# EAGLE design type-1 4 button (EAGLE 9.6.2)
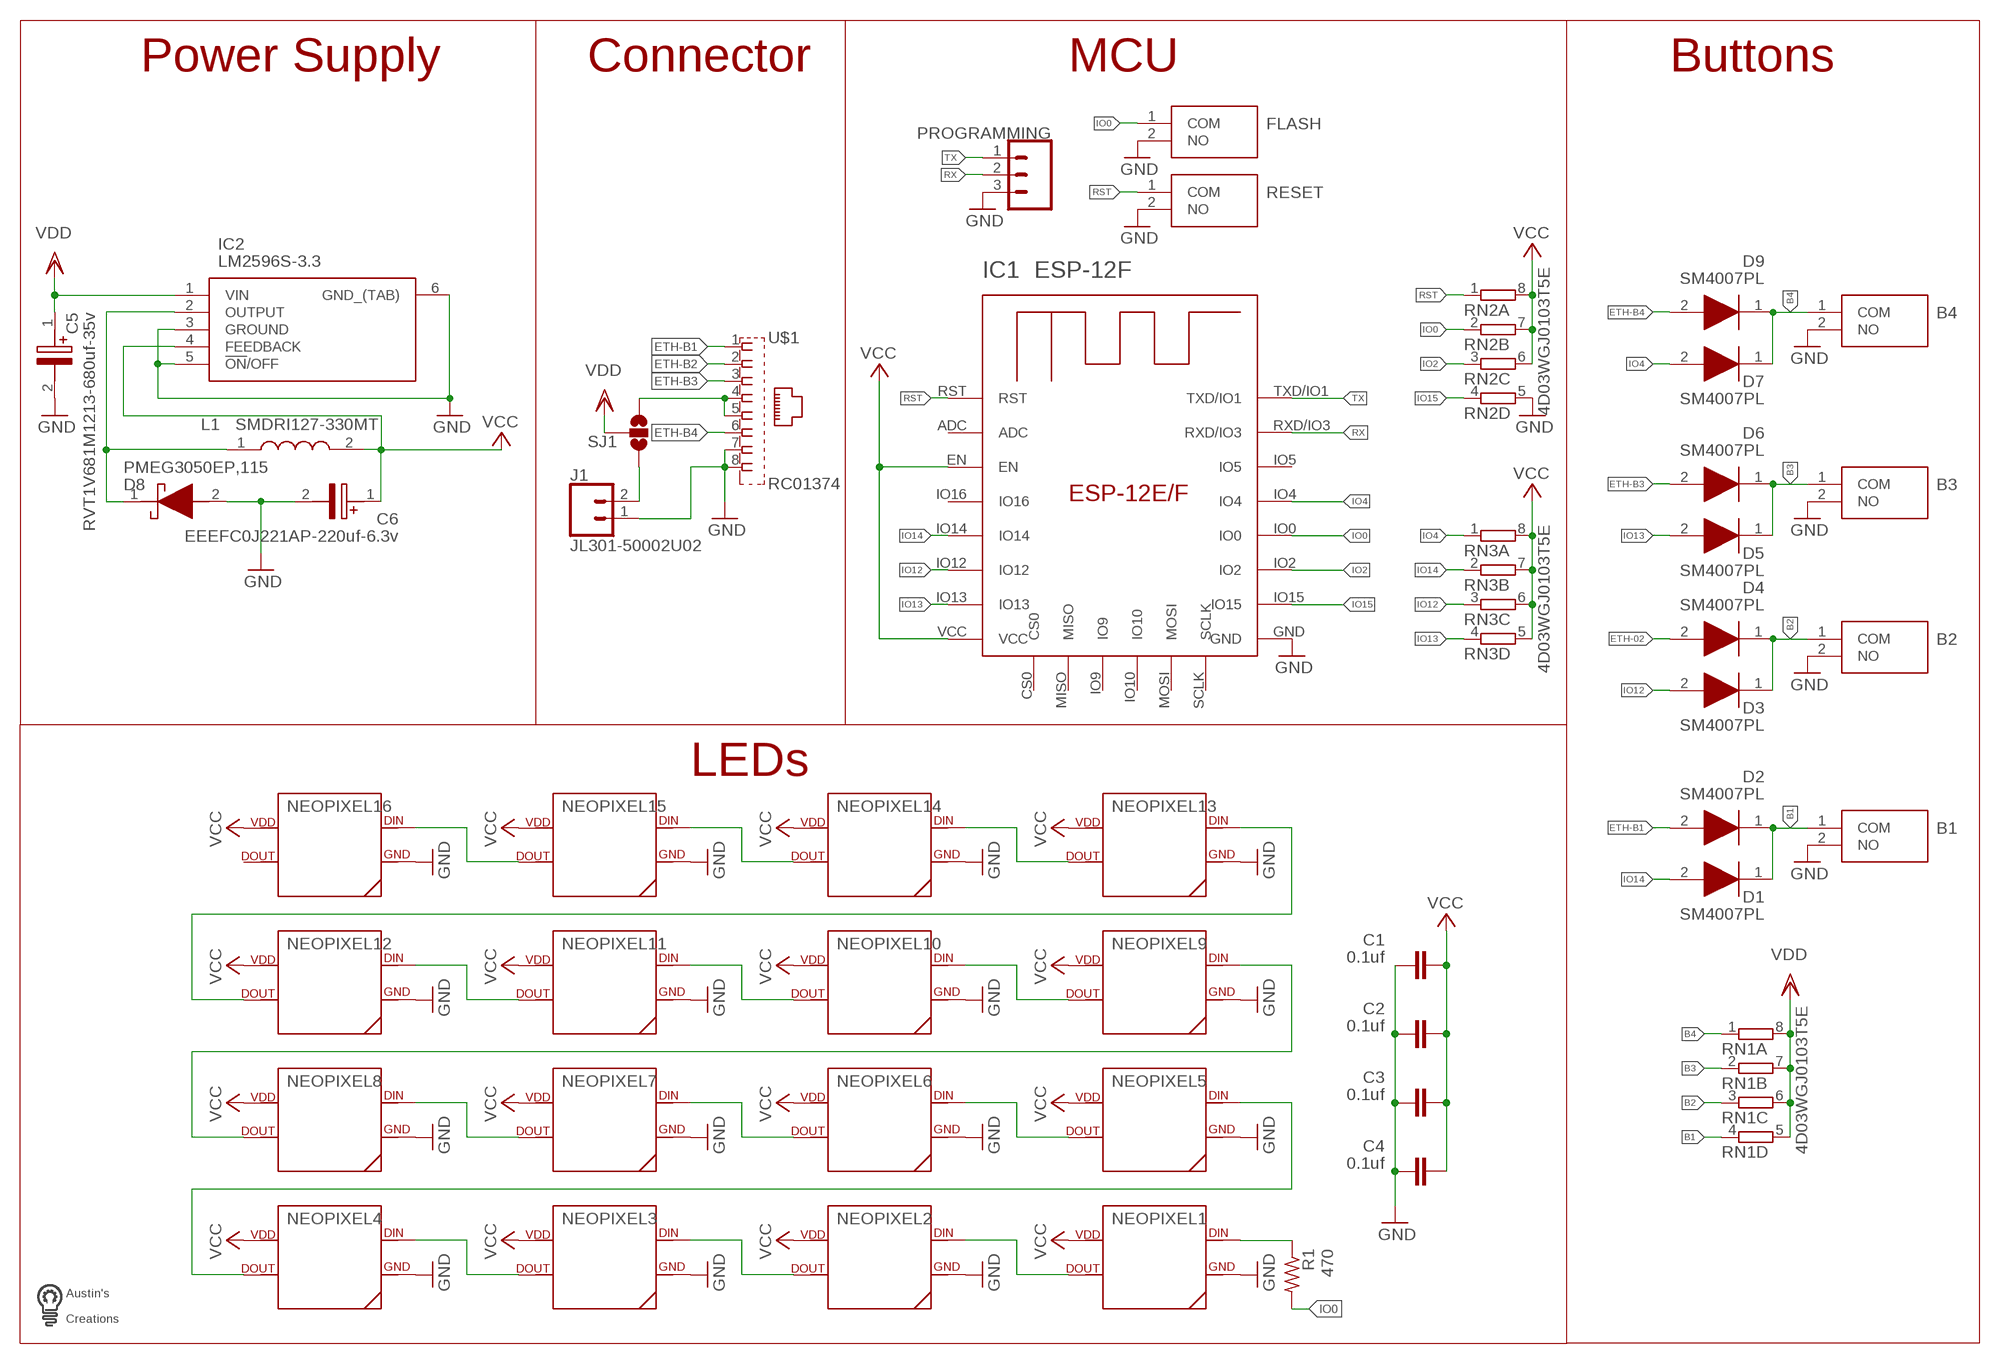
[diagram p0: schematic, sheet 1]

## Parts
B1  PTS636_SM25F_SMTR_LFS  [PTS636SM25FSMTRLFS]
B2  PTS636_SM25F_SMTR_LFS  [PTS636SM25FSMTRLFS]
B3  PTS636_SM25F_SMTR_LFS  [PTS636SM25FSMTRLFS]
B4  PTS636_SM25F_SMTR_LFS  [PTS636SM25FSMTRLFS]
C1  0.1uf  C-EUC0603  [C0603]
C2  0.1uf  C-EUC0603  [C0603]
C3  0.1uf  C-EUC0603  [C0603]
C4  0.1uf  C-EUC0603  [C0603]
C5  RVT1V681M1213-680uf-35v  EEE-HD1V681AQ  [CAPAE1350X1400N]
C6  EEEFC0J221AP-220uf-6.3v  EEEFC0J221AP  [CAPAE830X650N]
D1  SM4007PL  [SODFL3718X125N]
D2  SM4007PL  [SODFL3718X125N]
D3  SM4007PL  [SODFL3718X125N]
D4  SM4007PL  [SODFL3718X125N]
D5  SM4007PL  [SODFL3718X125N]
D6  SM4007PL  [SODFL3718X125N]
D7  SM4007PL  [SODFL3718X125N]
D8  PMEG3050EP,115  [PMEG3050EP115]
D9  SM4007PL  [SODFL3718X125N]
FLASH  PTS636_SM25F_SMTR_LFS  [PTS636SM25FSMTRLFS]
IC1  ESP-12F  ESP-12E/F  [ESP-12E]
IC2  LM2596S-3.3  LM2596S-3.3_NOPB  [TO170P1435X465-6N]
J1  JL301-50002U02  CONN_025MM  [SCREWTERMINAL-5MM-2]
L1  SMDRI127-330MT  CDRH127_LDNP-330MC  [INDPM120120X800N]
NEOPIXEL1  SK6812NEOPIXEL5050  [SK6812]
NEOPIXEL2  SK6812NEOPIXEL5050  [SK6812]
NEOPIXEL3  SK6812NEOPIXEL5050  [SK6812]
NEOPIXEL4  SK6812NEOPIXEL5050  [SK6812]
NEOPIXEL5  SK6812NEOPIXEL5050  [SK6812]
NEOPIXEL6  SK6812NEOPIXEL5050  [SK6812]
NEOPIXEL7  SK6812NEOPIXEL5050  [SK6812]
NEOPIXEL8  SK6812NEOPIXEL5050  [SK6812]
NEOPIXEL9  SK6812NEOPIXEL5050  [SK6812]
NEOPIXEL10  SK6812NEOPIXEL5050  [SK6812]
NEOPIXEL11  SK6812NEOPIXEL5050  [SK6812]
NEOPIXEL12  SK6812NEOPIXEL5050  [SK6812]
NEOPIXEL13  SK6812NEOPIXEL5050  [SK6812]
NEOPIXEL14  SK6812NEOPIXEL5050  [SK6812]
NEOPIXEL15  SK6812NEOPIXEL5050  [SK6812]
NEOPIXEL16  SK6812NEOPIXEL5050  [SK6812]
PROGRAMMING  455-1750-1-ND  CONN_03  [1X03]
R1  470  R-US_R0603  [R0603]
RESET  PTS636_SM25F_SMTR_LFS  [PTS636SM25FSMTRLFS]
RN1  4R-N0603-ARC  [0603-ARC]
RN2  4R-N0603-ARC  [0603-ARC]
RN3  4R-N0603-ARC  [0603-ARC]
SJ1  SOLDERJUMPER_2WAYPASTE1&2  [SJ_3_PASTE1&2]
U$1  RC01374  [RC01374]
U$2  LOGO  [LOGO]

## Nets
B1: B1.1(COM) D1.1(K) D2.1(K) RN1.4
B2: B2.1(COM) D3.1(K) D4.1(K) RN1.3
B3: B3.1(COM) D5.1(K) D6.1(K) RN1.2
B4: B4.1(COM) D7.1(K) D9.1(K) RN1.1
ETH-02: D4.2(A)
ETH-B1: D2.2(A) U$1.1
ETH-B2: U$1.2
ETH-B3: D6.2(A) U$1.3
ETH-B4: D9.2(A) U$1.6
GND: B1.2(NO) B2.2(NO) B3.2(NO) B4.2(NO) C1.1 C2.1 C3.1 C4.1 C5.2(-) C6.2(-) D8.2(A) FLASH.2(NO) IC1.GND IC2.3(GROUND) IC2.5(!ON!/OFF) IC2.6(GND_(TAB)) J1.1 NEOPIXEL1.3(GND) NEOPIXEL2.3(GND) NEOPIXEL3.3(GND) NEOPIXEL4.3(GND) NEOPIXEL5.3(GND) NEOPIXEL6.3(GND) NEOPIXEL7.3(GND) NEOPIXEL8.3(GND) NEOPIXEL9.3(GND) NEOPIXEL10.3(GND) NEOPIXEL11.3(GND) NEOPIXEL12.3(GND) NEOPIXEL13.3(GND) NEOPIXEL14.3(GND) NEOPIXEL15.3(GND) NEOPIXEL16.3(GND) PROGRAMMING.3 RESET.2(NO) RN2.5 U$1.7 U$1.8
IO0: FLASH.1(COM) IC1.IO0 R1.2 RN2.2
IO2: IC1.IO2 RN2.3
IO4: D7.2(A) IC1.IO4 RN3.1
IO12: D3.2(A) IC1.IO12 RN3.3
IO13: D5.2(A) IC1.IO13 RN3.4
IO14: D1.2(A) IC1.IO14 RN3.2
IO15: IC1.IO15 RN2.4
N$1: NEOPIXEL1.4(DIN) R1.1
N$2: NEOPIXEL1.2(DOUT) NEOPIXEL2.4(DIN)
N$3: NEOPIXEL2.2(DOUT) NEOPIXEL3.4(DIN)
N$4: NEOPIXEL3.2(DOUT) NEOPIXEL4.4(DIN)
N$5: NEOPIXEL4.2(DOUT) NEOPIXEL5.4(DIN)
N$6: NEOPIXEL8.2(DOUT) NEOPIXEL9.4(DIN)
N$7: NEOPIXEL12.2(DOUT) NEOPIXEL13.4(DIN)
N$8: NEOPIXEL5.2(DOUT) NEOPIXEL6.4(DIN)
N$9: NEOPIXEL9.2(DOUT) NEOPIXEL10.4(DIN)
N$10: NEOPIXEL13.2(DOUT) NEOPIXEL14.4(DIN)
N$11: NEOPIXEL6.2(DOUT) NEOPIXEL7.4(DIN)
N$12: NEOPIXEL10.2(DOUT) NEOPIXEL11.4(DIN)
N$13: NEOPIXEL14.2(DOUT) NEOPIXEL15.4(DIN)
N$14: NEOPIXEL7.2(DOUT) NEOPIXEL8.4(DIN)
N$15: NEOPIXEL11.2(DOUT) NEOPIXEL12.4(DIN)
N$16: NEOPIXEL15.2(DOUT) NEOPIXEL16.4(DIN)
N$17: SJ1.1 U$1.4 U$1.5
N$18: J1.2 SJ1.3
N$20: D8.1(K) IC2.2(OUTPUT) L1.1
RST: IC1.RST RESET.1(COM) RN2.1
RX: IC1.RXD/IO3 PROGRAMMING.2
TX: IC1.TXD/IO1 PROGRAMMING.1
VCC: C1.2 C2.2 C3.2 C4.2 C6.1(+) IC1.EN IC1.VCC IC2.4(FEEDBACK) L1.2 NEOPIXEL1.1(VDD) NEOPIXEL2.1(VDD) NEOPIXEL3.1(VDD) NEOPIXEL4.1(VDD) NEOPIXEL5.1(VDD) NEOPIXEL6.1(VDD) NEOPIXEL7.1(VDD) NEOPIXEL8.1(VDD) NEOPIXEL9.1(VDD) NEOPIXEL10.1(VDD) NEOPIXEL11.1(VDD) NEOPIXEL12.1(VDD) NEOPIXEL13.1(VDD) NEOPIXEL14.1(VDD) NEOPIXEL15.1(VDD) NEOPIXEL16.1(VDD) RN2.6 RN2.7 RN2.8 RN3.5 RN3.6 RN3.7 RN3.8
VDD: C5.1(+) IC2.1(VIN) RN1.5 RN1.6 RN1.7 RN1.8 SJ1.2
Unconnected: IC1.ADC IC1.CS0 IC1.IO5 IC1.IO9 IC1.IO10 IC1.IO16 IC1.MISO IC1.MOSI IC1.SCLK NEOPIXEL16.2(DOUT)

## Notes on the sheet
- Power Supply | Connector | MCU | Buttons
- 4D03WGJ0103T5E
- 4D03WGJ0103T5E
- LEDs
- 4D03WGJ0103T5E

## Library data of the parts
B1-B4 FLASH RESET = SamacSys_Parts:PTS636_SM25F_SMTR_LFS: Tactile Switches Tact 50mA 12VDC, 6.0x3.5, 2.5mm H, 180gf, F leads, No ground pin, White Actuator Source: Datasheet <https://ms.componentsearchengine.com/Datasheets/1/PTS636 SM25F SMTR LFS.pdf>; ARROW_PART_NUMBER: PTS636 SM25F SMTR LFS; ARROW_PRICE-STOCK: https://www.arrow.com/en/products/pts636-sm25f-smtr-lfs/ck; DESCRIPTION: Tactile Switches Tact 50mA 12VDC, 6.0x3.5, 2.5mm H, 180gf, F leads, No ground pin, White Actuator; HEIGHT: 2.7mm; MANUFACTURER_NAME: C & K COMPONENTS; MANUFACTURER_PART_NUMBER: PTS636 SM25F SMTR LFS; MOUSER_PART_NUMBER: 611-PTS636SM25FSMTRL; MOUSER_PRICE-STOCK: https://www.mouser.co.uk/ProductDetail/CK/PTS636-SM25F-SMTR-LFS?qs=vLWxofP3U2wcBTQSwfMFOw%3D%3D
C1-C4 = rcl:C-EU: CAPACITOR, European symbol; SPICEPREFIX: C
C5 = SamacSys_Parts:EEE-HD1V681AQ: Aluminium Electrolytic Capacitors - SMD 35VDC 680uF 20% AEC-Q200 Source: Datasheet <https://industrial.panasonic.com/cdbs/www-data/pdf/RDE0000/ABA0000C1166.pdf>; DESCRIPTION: Aluminium Electrolytic Capacitors - SMD 35VDC 680uF 20% AEC-Q200; HEIGHT: 14mm; MANUFACTURER_NAME: Panasonic; MANUFACTURER_PART_NUMBER: EEE-HD1V681AQ; MOUSER_PART_NUMBER: 667-EEE-HD1V681AQ; MOUSER_PRICE-STOCK: https://www.mouser.co.uk/ProductDetail/Panasonic/EEE-HD1V681AQ?qs=w%2Fv1CP2dgqoW7i2Hoqi%252B9w%3D%3D
C6 = SamacSys_Parts:EEEFC0J221AP: PANASONIC - EEEFC0J221AP - SMD Aluminium Electrolytic Capacitor, Radial Can - SMD, 220 F, 6.3 V, EEEFC Series Source: Datasheet <https://industrial.panasonic.com/cdbs/www-data/pdf/RDE0000/ABA0000C1169.pdf>; DESCRIPTION: PANASONIC - EEEFC0J221AP - SMD Aluminium Electrolytic Capacitor, Radial Can - SMD, 220 F, 6.3 V, EEEFC Series; HEIGHT: 6.5mm; MANUFACTURER_NAME: Panasonic; MANUFACTURER_PART_NUMBER: EEEFC0J221AP
D1-D7 D9 = SamacSys_Parts:SM4007PL: 1kV 1A 1.1V @ 1A SOD-123FL Diodes - General Purpose RoHS Source: Datasheet <https://datasheet.lcsc.com/szlcsc/1903051030_MDD-Jiangsu-Yutai-Elec-SM4007PL_C64898.pdf>; DESCRIPTION: 1kV 1A 1.1V @ 1A SOD-123FL Diodes - General Purpose RoHS; HEIGHT: 1.25mm; MANUFACTURER_NAME: MDD(Microdiode Electronics); MANUFACTURER_PART_NUMBER: SM4007PL
D8 = SamacSys_Parts:PMEG3050EP,115: NXP PMEG3050EP,115 SMT Schottky Diode, 30V 5A, 2-Pin SOD-128 Source: Datasheet <https://docs-emea.rs-online.com/webdocs/14cd/0900766b814cd012.pdf>; ARROW_PART_NUMBER: PMEG3050EP,115; ARROW_PRICE-STOCK: https://www.arrow.com/en/products/pmeg3050ep115/nexperia; DESCRIPTION: NXP PMEG3050EP,115 SMT Schottky Diode, 30V 5A, 2-Pin SOD-128; HEIGHT: 1mm; MANUFACTURER_NAME: Nexperia; MANUFACTURER_PART_NUMBER: PMEG3050EP,115; MOUSER_PART_NUMBER: 771-PMEG3050EP115; MOUSER_PRICE-STOCK: https://www.mouser.co.uk/ProductDetail/Nexperia/PMEG3050EP115?qs=GcY6OjH1zdmnjQ%2FhUT5aOA%3D%3D
IC1 = custom parts:ESP-12E/F
IC2 = SamacSys_Parts:LM2596S-3.3_NOPB: SIMPLE SWITCHER® 4.5V to 40V, 3A Low Component Count Step-Down Regulator Source: Datasheet <http://www.ti.com/lit/ds/symlink/lm2596.pdf>; DESCRIPTION: SIMPLE SWITCHER&#174; 4.5V to 40V, 3A Low Component Count Step-Down Regulator; HEIGHT: 4.65mm; MANUFACTURER_NAME: Texas Instruments; MANUFACTURER_PART_NUMBER: LM2596S-3.3/NOPB; MOUSER_PART_NUMBER: 926-LM2596S-3.3/NOPB; MOUSER_PRICE-STOCK: https://www.mouser.co.uk/ProductDetail/Texas-Instruments/LM2596S-33-NOPB?qs=X1J7HmVL2ZHsEwG9Q6doow%3D%3D
J1 = SparkFun-Connectors:CONN_02: Multi connection point. Often used as Generic Header-pin footprint for 0.1 inch spaced/style header connections On any of the 0.1 inch spaced packages, you can populate with these: Break Away Headers - Straight <https://www.sparkfun.com/products/116> (PRT-00116) Break Away Male Headers - Right Angle <https://www.sparkfun.com/products/553> (PRT-00553) Female Headers <https://www.sparkfun.com/products/115> (PRT-00115) Break Away Headers - Machine Pin <https://www.sparkfun.com/products/117> (PRT-00117) Break Away Female Headers - Swiss Machine Pin <https://www.sparkfun.com/products/743> (PRT-00743) For SCREWTERMINALS and SPRING TERMINALS visit here: Screw Terimnals on SparkFun.com <https://www.sparkfun.com/search/results?term=Screw+Terminals> (5mm/3.5mm/2.54mm spacing) This device is also useful as a general connection point to wire up your design to another part of your project. Our various solder wires solder well into these plated through hole pads. Hook-Up Wire - Assortment (Stranded, 22 AWG) <https://www.sparkfun.com/products/11375> (PRT-11375) Hook-Up Wire - Assortment (Solid Core, 22 AWG) <https://www.sparkfun.com/products/11367> (PRT-11367) View the entire wire category on our website here <https://www.sparkfun.com/categories/141> Special notes: Molex polarized connector foot print use with: PRT-08233 with associated crimp pins and housings. 2.54_SCREWTERM for use with PRT-10571. 3.5mm Screw Terminal footprints for PRT-08084 5mm Screw Terminal footprints for use with PRT-08432; SF_SKU: PRT-08432
L1 = SamacSys_Parts:CDRH127_LDNP-330MC: Fixed Inductors 33uH 3.9A Source: Datasheet <https://products.sumida.com/products/pdf/CDRH127LD.pdf>; DESCRIPTION: Fixed Inductors 33uH 3.9A; HEIGHT: 8mm; MANUFACTURER_NAME: Sumida; MANUFACTURER_PART_NUMBER: CDRH127/LDNP-330MC; MOUSER_PART_NUMBER: 851-CDRH127LDNP330MC; MOUSER_PRICE-STOCK: https://www.mouser.co.uk/ProductDetail/Sumida/CDRH127-LDNP-330MC?qs=rZntyWl5IYHj3wgmnQ0WOg%3D%3D
NEOPIXEL1-NEOPIXEL16 = custom parts:SK6812: for 5050 sk6812 LED
PROGRAMMING = SparkFun-Connectors:CONN_03: Multi connection point. Often used as Generic Header-pin footprint for 0.1 inch spaced/style header connections On any of the 0.1 inch spaced packages, you can populate with these: Break Away Headers - Straight <https://www.sparkfun.com/products/116> (PRT-00116) Break Away Male Headers - Right Angle <https://www.sparkfun.com/products/553> (PRT-00553) Female Headers <https://www.sparkfun.com/products/115> (PRT-00115) Break Away Headers - Machine Pin <https://www.sparkfun.com/products/117> (PRT-00117) Break Away Female Headers - Swiss Machine Pin <https://www.sparkfun.com/products/743> (PRT-00743) Stackable Header - 3 Pin (Female, 0.1") <https://www.sparkfun.com/products/13875> (PRT-13875) For SCREWTERMINALS and SPRING TERMINALS visit here: Screw Terimnals on SparkFun.com <https://www.sparkfun.com/search/results?term=Screw+Terminals> (5mm/3.5mm/2.54mm spacing) This device is also useful as a general connection point to wire up your design to another part of your project. Our various solder wires solder well into these plated through hole pads. Hook-Up Wire - Assortment (Stranded, 22 AWG) <https://www.sparkfun.com/products/11375> (PRT-11375) Hook-Up Wire - Assortment (Solid Core, 22 AWG) <https://www.sparkfun.com/products/11367> (PRT-11367) View the entire wire category on our website here <https://www.sparkfun.com/categories/141> Special notes: Molex polarized connector foot print use with SKU : PRT-08232 with associated crimp pins and housings.; PROD_ID: XXX-00000
R1 = resistor:R-US_: RESISTOR, American symbol
RN1-RN3 = custom parts:4R-N: Array Chip Resistor Source: RS Component / Phycomp; OC_FARNELL: unknown; OC_NEWARK: unknown
SJ1 = SparkFun-Retired:SOLDERJUMPER_2WAY: Solder Jumper 2 way solder jumper
U$1 = custom parts:RC01374
U$2 = custom parts:LOGO

## Board
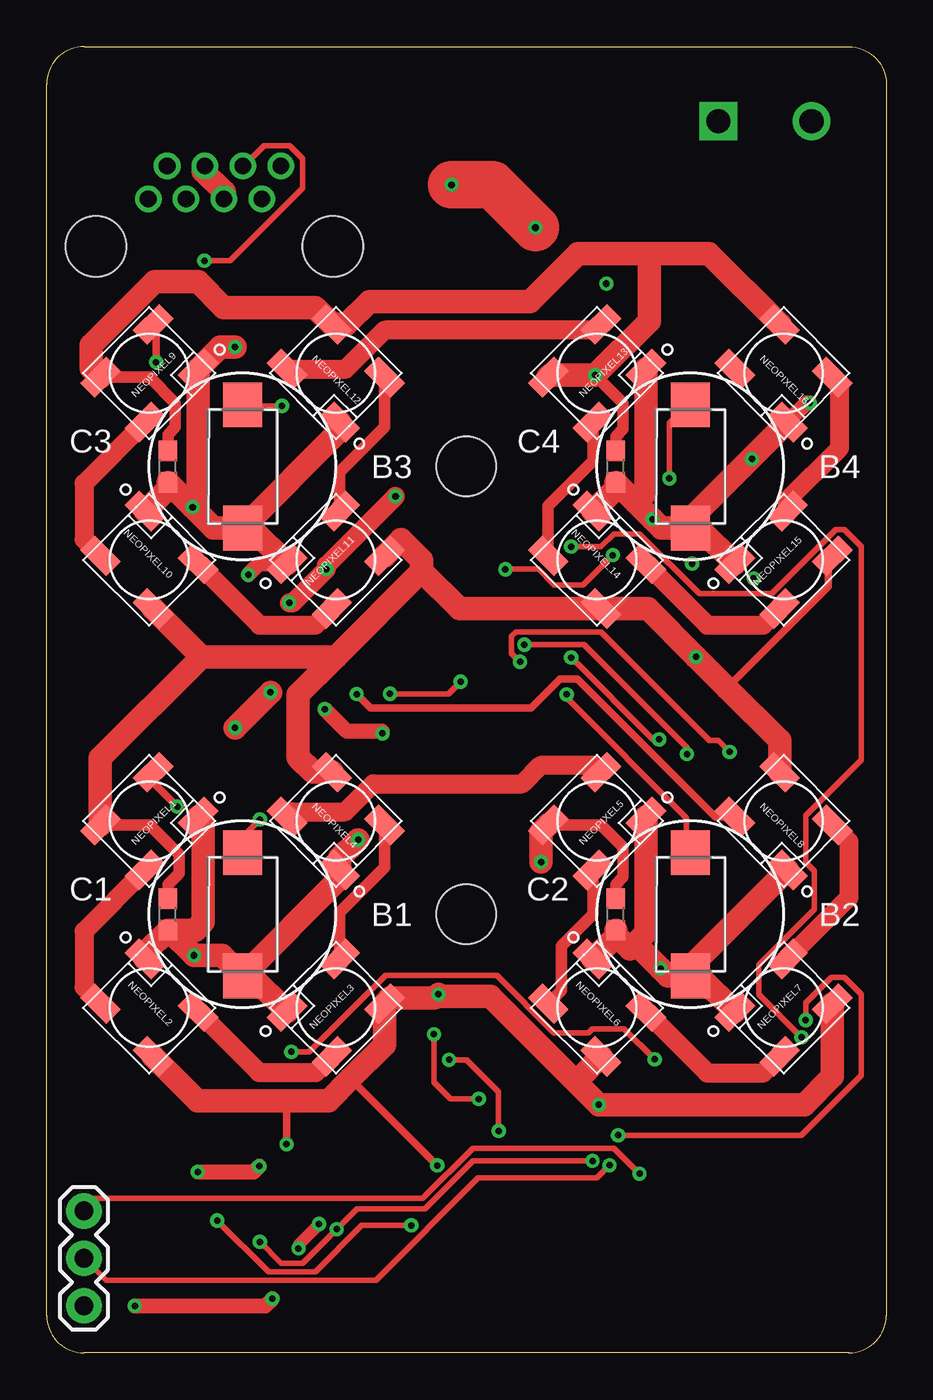
[diagram p1: board, top side]
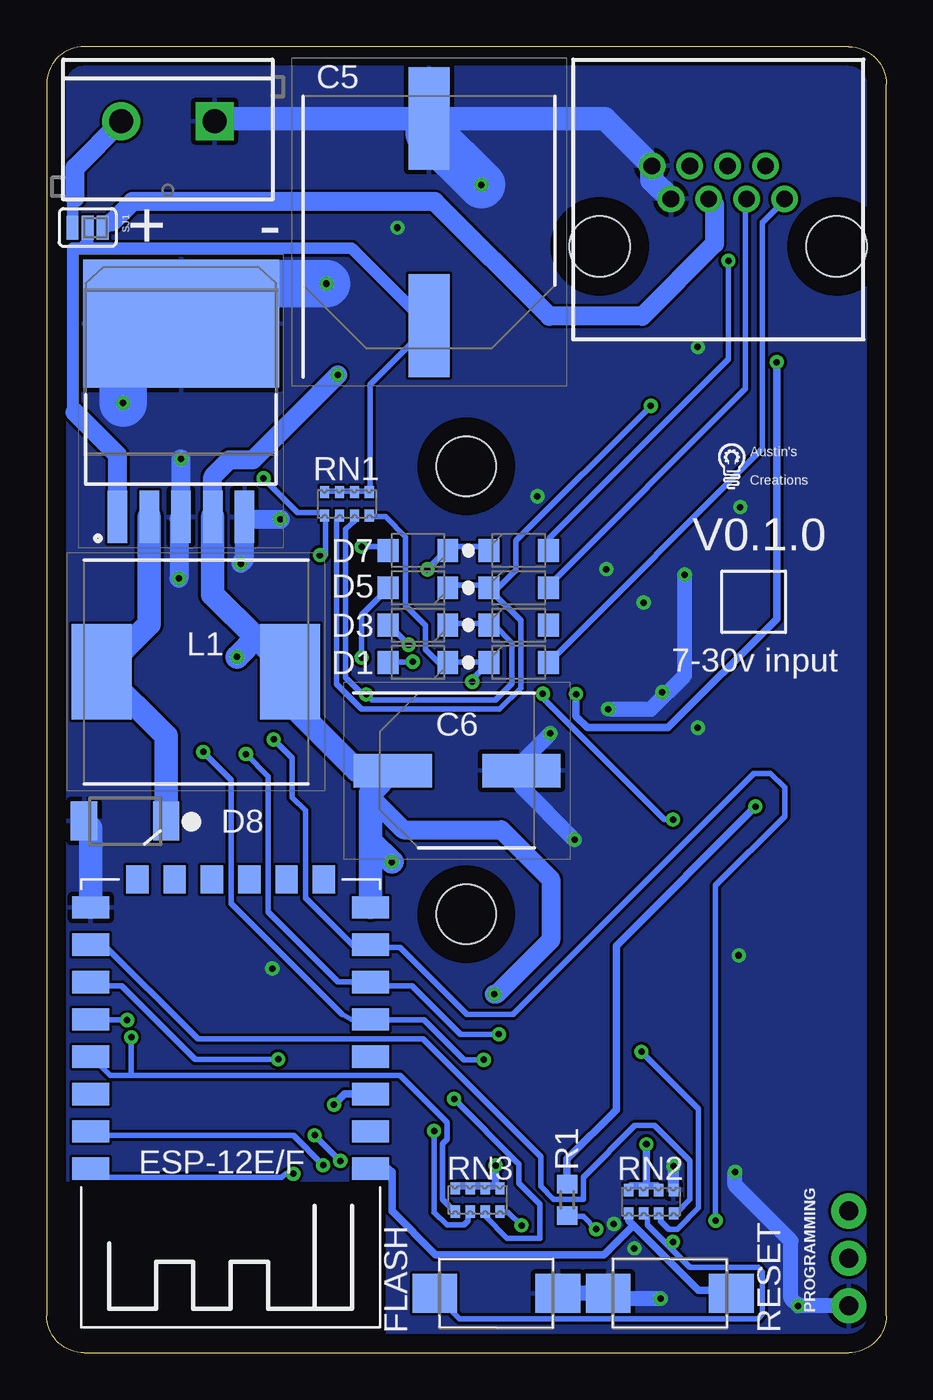
[diagram p2: board, bottom side, seen from below]

Size 45 x 70 mm. Coordinates in mm from the lower left corner, seen from the top.
Outline: 0,2 0,68 arc-90 2,70 43,70 arc-90 45,68 45,2 arc-90 43,0 2,0 arc-90 0,2
Copper layers (1*16): Top 0.035mm / dielectric 1.5mm / Bottom 0.035mm
Design rules "default *": minimum track width 12mil, minimum drill 0.35mm, track to track 6mil, track to pad 6mil, pad to pad 6mil, via to via 6mil, smd to smd 6mil, copper to edge 40mil, drill to drill 6mil, minimum pad ring 10mil, minimum via ring 8mil, stop-mask expansion 4mil, vias tented up to drill 0mil, thermal gap 10mil
Holes 3.2 mm at 22.5,47.5 22.5,23.5

### Footprints (pad centres in the part's own frame; a part is rotated, then mirrored left to right if it is on the bottom)
PTS636SM25FSMTRLFS = smd 2.4 x 2.1: 1 -3.3,0; 2 3.3,0
C0603 = smd 1.1 x 1: 1 -0.85,0; 2 0.85,0
CAPAE1350X1400N = smd 5.5 x 2.2: 1 -5.55,0; 2 5.55,0
CAPAE830X650N = smd 4.2 x 1.8: 1 -3.45,0; 2 3.45,0
SODFL3718X125N = smd 1.12 x 1.22: 1 -1.6,0; 2 1.6,0
PMEG3050EP115 = smd 1.4 x 2.1: 1 -2.2,0; 2 2.2,0
ESP-12E = smd 2 x 1.2: ADC -7.46,5.53; EN -7.46,3.53; GND 7.54,-6.47; IO0 7.54,-0.47; IO2 7.54,-2.47; IO4 7.54,1.53; IO5 7.54,3.53; IO12 -7.46,-2.47; IO13 -7.46,-4.47; IO14 -7.46,-0.47; IO15 7.54,-4.47; IO16 -7.46,1.53; RST -7.46,7.53; RXD/IO3 7.54,5.53; TXD/IO1 7.54,7.53; VCC -7.46,-6.47 | smd 1.2 x 1.5: CS0 -4.96,-7.97; IO9 -0.96,-7.97; IO10 1.04,-7.97; MISO -2.96,-7.97; MOSI 3.04,-7.97; SCLK 5.04,-7.97
TO170P1435X465-6N = smd 2.8 x 1.05: 1 -6.2,3.4; 2 -6.2,1.7; 3 -6.2,0; 4 -6.2,-1.7; 5 -6.2,-3.4 | smd 6.85 x 10.5: 6 4.15,0
SCREWTERMINAL-5MM-2 = drill 1.3 pad 2.032 square: 1 0,0 | drill 1.3 pad 2.032: 2 5,0
INDPM120120X800N = smd 3.2 x 5.1: 1 -5.05,0; 2 5.05,0
SK6812 = smd 2 x 1.1: 1 -2,1.7; 2 -2,-1.7; 3 2,-1.7; 4 2,1.7
1X03 = drill 1.016 pad 1.88: 1 0,0; 2 2.54,0; 3 5.08,0
R0603 = smd 1 x 1.1: 1 -0.85,0; 2 0.85,0
0603-ARC = smd 0.5 x 0.65: 1 -1.2,-0.625; 2 -0.4,-0.625; 3 0.4,-0.625; 4 1.2,-0.625; 5 1.2,0.625; 6 0.4,0.625; 7 -0.4,0.625; 8 -1.2,0.625
SJ_3_PASTE1&2 = smd 0.635 x 1.27: 1 -0.813,0; 2 0,0; 3 0.813,0
RC01374 = drill 0.889 pad 1.422: 1 3.556,2.54; 2 2.54,4.318; 3 1.524,2.54; 4 0.508,4.318; 5 -0.508,2.54; 6 -1.524,4.318; 7 -2.54,2.54; 8 -3.556,4.318 | hole 3.251: 6.35,0; -6.35,0

### Placement (x,y rotation side)
B1  10.5,23.5 270 top
B2  34.5,23.5 270 top
B3  10.5,47.5 270 top
B4  34.5,47.5 270 top
C1  6.5,23.5 90 top
C2  30.5,23.5 90 top
C3  6.5,47.5 90 top
C4  30.5,47.5 90 top
C5  24.5,60.6 90 bottom
C6  23,31.2 0 bottom
D1  25.1,37 180 bottom
D2  19.7,37 0 bottom
D3  25.1,39 180 bottom
D4  19.7,39 0 bottom
D5  25.1,41 180 bottom
D6  19.7,41 0 bottom
D7  25.1,43 180 bottom
D8  40.8,28.5 180 bottom
D9  19.7,43 0 bottom
FLASH  20.9,3.2 0 bottom
IC1  35.1,17.4 180 bottom
IC2  37.8,51 90 bottom
J1  36,66 180 bottom
L1  37,36.5 0 bottom
NEOPIXEL1  5.5,28.5 45 top
NEOPIXEL2  5.5,18.5 135 top
NEOPIXEL3  15.5,18.5 225 top
NEOPIXEL4  15.5,28.5 315 top
NEOPIXEL5  29.5,28.5 45 top
NEOPIXEL6  29.5,18.5 135 top
NEOPIXEL7  39.5,18.5 225 top
NEOPIXEL8  39.5,28.5 315 top
NEOPIXEL9  5.5,52.5 45 top
NEOPIXEL10  5.5,42.5 135 top
NEOPIXEL11  15.5,42.5 225 top
NEOPIXEL12  15.5,52.5 315 top
NEOPIXEL13  29.5,52.5 45 top
NEOPIXEL14  29.5,42.5 135 top
NEOPIXEL15  39.5,42.5 225 top
NEOPIXEL16  39.5,52.5 315 top
PROGRAMMING  2,7.6 270 top
R1  17.1,8.2 270 bottom
RESET  11.6,3.2 180 bottom
RN1  28.9,45.5 0 bottom
RN2  12.6,8.1 0 bottom
RN3  21.9,8.2 0 bottom
SJ1  42.8,60.3 180 bottom
U$1  9,59.3 0 bottom
U$2  9,46.3 0 bottom

### Tracks (layer width: path | path; a pad name or v marks a point on that pad's centre or on a via)
B1  (via drill 0.35)
  Top 0.305: v11.43,28.57 10.52,27.66 10.52,26.98 B1.1 | v18.4,35.32 21.55,35.32 v22.19,35.96
  Bottom 0.305: RN1.4 27.66,44.81 26.85,44.81 25.76,43.72 25.76,40.05 24.7,38.99 24.7,37.7 24,37 D1.1 23.32,37.03 21.49,37.03 D2.1 22.19,36.08 v22.19,35.96 | v11.43,28.57 11.89,28.57 18.4,35.09 v18.4,35.32
B2  (via drill 0.35)
  Top 0.305: v27.88,35.29 27.88,35.09 34.29,28.68 34.29,26.98 B2.1
  Bottom 0.305: RN1.3 28.5,44.58 28.98,44.13 28.98,36.19 28.07,35.29 v27.88,35.29 27.56,34.98 20.93,34.98 20.05,35.86 20.05,38.05 21,39 D4.1 21.49,39.09 23.32,39.09 D3.1
B3  (via drill 0.35)
  Top 0.305: v12.62,50.75 10.52,50.75 B3.1
  Bottom 0.305: RN1.2 29.46,44.71 29.46,35.83 28.13,34.5 20.72,34.5 19.59,35.63 19.59,39.25 21.26,40.92 D6.1 | D5.1 23.32,41.15 21.49,41.15 D6.1 | v12.62,50.75 19.84,43.52 19.84,41.96 20.81,41 D6.1
B4  (via drill 0.35)
  Top 0.305: v33.38,46.86 33.38,49.84 34.29,50.75 B4.1 | v24.59,41.99 26.36,41.99 27.2,41.15 28.75,41.15 v30.35,42.75
  Bottom 0.305: D9.1 21.49,43.2 23.32,43.2 D7.1 23.52,43.06 v24.59,41.99 | v33.38,46.86 31.55,45.03 30.18,45.03 RN1.1 30.05,44.82 30.05,42.75 v30.35,42.75
ETH-B1
  Bottom 0.305: D2.2 18.06,37.03 6.63,48.46 6.63,60.58 5.49,61.72 U$1.1
ETH-B3
  Bottom 0.305: D6.2 18.06,41.15 7.54,51.66 7.54,61.72 U$1.3
ETH-B4  (via drill 0.35)
  Top 0.305: v8.46,58.52 9.83,58.52 13.72,62.41 13.72,64.01 13.03,64.69 11.66,64.69 10.74,63.78 U$1.6
  Bottom 0.305: v8.46,58.52 8.46,53.26 18.06,43.66 18.06,43.2 D9.2
GND  (via drill 0.35)
  Top 0.61: v14.6,6.9 13.5,5.8 v13.5,5.6
  Top 0.813: v8.1,9.7 11.1,9.7 v11.4,10 | v4.72,2.52 11.72,2.52 v12.1,2.9 | v18,33.2 18,33.3 16.1,33.3 v14.9,34.5 | v10.8,41.7 11.39,42.29 NEOPIXEL11.3 | NEOPIXEL16.3 40.73,50.9 v40.9,50.9
  Top 1.016: v18.7,45.9 15,42.2 v15,42 13.2,40.2 v13,40.2
  Top 1.27: B1.2 15.71,25.41 NEOPIXEL4.3 15.71,26.51 v16.7,27.5 | NEOPIXEL2.3 5.29,21.44 C1.1 | C1.1 6.55,22.65 v7.9,21.3 9.4,21.3 B1.2 | C1.1 7.95,22.65 8.4,23.1 8.4,28.43 NEOPIXEL1.3 | NEOPIXEL3.3 10.97,20.2 B1.2 | NEOPIXEL7.3 34.97,20.2 B2.2 | B2.2 33.3,20.2 v32.9,20.6 31.55,21.95 | NEOPIXEL6.3 30.5,22.33 C2.1 30.5,22.4 31.25,21.65 31.55,21.95 | NEOPIXEL5.3 32.12,22.52 31.55,21.95 | NEOPIXEL8.3 34.5,20.67 B2.2 | B4.2 32.95,44.2 v32.48,44.67 31.57,45.58 | 31.57,45.58 C4.1 30.5,46.33 NEOPIXEL14.3 | B4.2 34.97,44.2 NEOPIXEL15.3 | B4.2 34.5,44.67 NEOPIXEL16.3 | NEOPIXEL13.3 32.12,46.12 31.57,45.58 | B3.2 8.95,44.2 v7.83,45.33 | v7.83,45.33 C3.1 6.5,46.33 NEOPIXEL10.3 | B3.2 10.97,44.2 NEOPIXEL11.3 | B3.2 15.71,49.41 NEOPIXEL12.3 | v7.83,45.33 8.12,45.62 NEOPIXEL9.3 9.3,53.9 v10.1,53.9 | v12,35.4 v10.1,33.5
  Top 2.54: v21.7,62.6 23.9,62.6 v26.2,60.3
  Bottom 0.61: v11.4,10 RN2.5
  Bottom 0.813: PROGRAMMING.3 v4.72,2.52 5.1,2.9 5.1,6 8.1,9 v8.1,9.7 | v12.1,2.9 14.6,2.9 RESET.2 FLASH.2 | v16.7,27.5 19.55,30.35 C6.2 19.55,31.65 v18,33.2 | v14.9,34.5 12.6,34.5 10.8,36.3 v10.8,41.7
  Bottom 1.016: v37.8,47.9 IC2.3 37.9,44.7 v37.9,41.5 | v34.6,42.3 34.4,42.5 IC2.5 34.27,44.67 v32.48,44.67
  Bottom 1.27: IC1.GND 42.64,28.14 D8.2 | U$1.7 12.56,62.86 U$1.8 15.09,66.15 C5.2 35.85,66.15 J1.1
  Bottom 2.54: v30,57.3 36.4,57.3 40.9,52.8 v40.9,50.9 | C5.2 24.5,65.4 v21.7,62.6
  pour Bottom: 0,0 0,70 45,70 45,9.2 26.8,9.2 26.8,0
IO0  (via drill 0.35)
  Top 0.305: v11.43,5.94 12.57,4.8 13.72,4.8 v15.54,6.63 16.63,7.71 20.29,7.71 22.86,10.29 v29.26,10.29 | v40.69,17.83 40.69,18.75 42.06,20.12 42.75,20.12 43.66,19.2 43.66,14.86 40.46,11.66 v30.63,11.66
  Bottom 0.305: 11.66,5.71 10.52,4.57 6.86,4.57 6.63,4.34 6.63,2.06 6.86,1.83 22.86,1.83 24,2.97 FLASH.1 | 11.66,5.71 12.8,6.86 12.8,7.32 RN2.2 | v15.54,6.63 16.23,7.32 16.92,7.32 R1.2 | 11.66,5.71 v11.43,5.94 | v40.69,17.83 42.52,17.83 IC1.IO0 | v29.26,10.29 v30.63,11.66
IO2  (via drill 0.35)
  Top 0.305: v13.12,16.13 14.07,16.13 18.16,20.22 24.13,20.22 27.2,17.14 29.03,17.14 29.26,17.37 30.95,17.37 v32.59,15.73
  Bottom 0.305: v13.12,16.13 10.06,13.07 10.06,7.77 11.2,6.63 11.66,6.63 12.12,7.09 12.12,7.32 RN2.3 | v32.59,15.73 37.05,15.73 40.98,19.66 42.52,19.66 IC1.IO2
IO4  (via drill 0.35)
  Top 0.305: v28.12,43.2 29.72,43.2 30.4,43.89 31.77,43.89 34.98,40.69 38.86,40.69 42.29,44.12 42.75,44.12 43.66,43.2 43.66,31.77 40.69,28.8 40.69,26.29 41.15,25.83 41.15,23.77 38.18,20.8 38.18,19.2 v40.46,16.92
  Bottom 0.305: 40.46,14.86 41.6,14.86 42.52,15.77 IC1.IO4 | 40.46,14.86 26.06,14.86 23.55,12.34 23.55,11.43 23.77,11.2 23.77,8.23 23.32,7.77 RN3.1 | v28.12,43.2 26.75,43.2 D7.2 | 40.46,14.86 v40.46,16.92
IO12  (via drill 0.35)
  Top 0.305: v20.76,17.07 20.76,14.5 21.66,13.6 v23.16,13.6 | v25.6,37.95 28.8,37.95 34.32,32.43 v34.32,32.09
  Bottom 0.305: v23.16,13.6 19.67,10.12 19.67,9.09 18.56,7.97 18.56,6.14 20.32,6.14 21.49,7.32 21.49,7.54 RN3.3 | v20.76,17.07 22.82,17.07 25.4,19.66 27.43,19.66 IC1.IO12 29.38,19.87 29.38,19.88 33.12,23.62 33.12,30.89 v34.32,32.09 | v25.6,37.95 26.52,38.86 D3.2
IO13  (via drill 0.35)
  Top 0.305: v19.55,6.83 16.89,6.83 14.4,4.34 11.89,4.34 v9.14,7.09 | v28.12,37.26 32.5,32.88 v32.83,32.88
  Bottom 0.305: v19.55,6.83 20.26,7.54 20.57,7.54 RN3.4 | v9.14,7.09 9.14,25.05 5.44,28.75 5.44,30.3 6.2,31.06 7.09,31.06 20.02,18.13 22.47,18.13 26.06,21.72 27.43,21.72 IC1.IO13 28.53,21.87 28.54,21.8 31.13,24.39 31.13,29.06 31.83,29.76 31.83,31.88 v32.83,32.88 | v28.12,37.26 28.12,39.55 26.75,40.92 D5.2
IO14  (via drill 0.35)
  Top 0.305: v21.57,15.7 22.52,15.7 24.23,13.99 v24.23,11.89 | v25.38,37.03 24.92,37.49 24.92,38.41 25.15,38.63 29.7,38.63 35.53,32.8 36,32.8 v36.6,32.2
  Bottom 0.305: v24.23,11.89 24.23,7.54 23.55,6.86 22.63,6.86 22.4,7.09 22.4,7.54 RN3.2 | v21.57,15.7 22.63,15.7 24.76,17.83 27.43,17.83 IC1.IO14 28.65,17.87 29.18,18.15 35.1,24.07 35.1,30.7 v36.6,32.2 | v25.38,37.03 26.52,37.03 D1.2
IO15
  Bottom 0.305: RN2.4 11.2,7.54 10.52,8.23 10.52,10.29 12.42,12.19 13.46,12.19 16.23,9.41 16.23,8.23 17.83,8.23 18.52,8.91 18.52,10.5 24.83,16.82 36.89,16.82 42.21,22.14 IC1.IO15
N$1  (via drill 0.35)
  Top 0.406: v7.01,29.27 5.71,30.57 NEOPIXEL1.4
  Bottom 0.406: R1.1 17.1,10.38 14.47,13.02 14.47,21.81 v7.01,29.27
N$2
  Top 1.016: NEOPIXEL1.2 2,22.6 2,19.6 NEOPIXEL2.4
N$3
  Top 1.016: NEOPIXEL2.2 11.38,15.02 14.43,15.02 NEOPIXEL3.4
N$4
  Top 0.61: NEOPIXEL4.4 18.12,26.02 15.71,23.61 NEOPIXEL3.2
N$5
  Top 1.016: NEOPIXEL4.2 13.17,29 16,29 17.5,30.5 25.5,30.5 26.5,31.5 29.33,31.5 NEOPIXEL5.4
N$6  (via drill 0.35)
  Top 0.406: v5.87,53.09 5.87,55.04 NEOPIXEL9.4 | v16.62,35.3 17.37,34.55 25.97,34.55 27.52,36.1 28.45,36.1 35.85,28.71 NEOPIXEL8.2
  Bottom 0.406: v5.87,53.09 5.87,39.33 11.69,33.5 16.02,33.5 16.62,34.1 v16.62,35.3
N$7
  Top 1.016: NEOPIXEL12.2 16.01,52.71 18.1,54.8 29.4,54.8 NEOPIXEL13.4
N$8
  Top 0.61: NEOPIXEL5.2 29.29,23.49 27.6,21.8 27.6,19.43 NEOPIXEL6.4
N$9
  Top 1.016: NEOPIXEL9.2 2,46.6 2,43.6 NEOPIXEL10.4
N$10
  Top 0.61: NEOPIXEL13.2 29.29,47.79 26.88,45.38 NEOPIXEL14.4
N$11
  Top 1.016: NEOPIXEL6.2 35.4,15 38.4,15 NEOPIXEL7.4
N$12
  Top 1.016: NEOPIXEL10.2 11.4,39 14.4,39 NEOPIXEL11.4
N$13
  Top 1.016: NEOPIXEL14.2 35.4,39 38.4,39 NEOPIXEL15.4
N$14
  Top 1.016: NEOPIXEL8.4 43,27.4 43,24.4 NEOPIXEL7.2
N$15
  Top 0.61: NEOPIXEL11.2 15.71,47.21 18.12,49.62 NEOPIXEL12.4
N$16
  Top 1.016: NEOPIXEL15.2 39.71,45.71 42.5,48.5 42.5,51.9 NEOPIXEL16.4
N$17
  Top 1.27: U$1.4 8.4,63.53 8.4,63.34 9.51,62.23 U$1.5
  Bottom 0.61: 41.5,60.6 41.8,60.3 SJ1.1
  Bottom 1.016: U$1.5 9.2,61.53 9.2,59.43 13.08,55.55 18.05,55.55 24.2,61.7 40.4,61.7 41.5,60.6
N$18
  Bottom 0.61: SJ1.3 43.61,61.76 43.48,61.9
  Bottom 1.016: J1.2 43.48,63.52 43.48,61.9
N$20
  Bottom 1.27: D8.1 38.6,33.05 L1.1 39.5,39.05 IC2.2
RST
  Bottom 0.406: 13.55,6.84 10.06,3.35 8.5,3.35 RESET.1 | 13.55,6.84 13.79,7.08 13.79,7.46 RN2.1 | 13.55,6.84 15.13,5.27 24.17,5.27 26.5,7.6 26.5,9.7 26.67,9.87 IC1.RST
RX  (via drill 0.35)
  Top 0.305: v30.18,10.06 29.49,9.37 23.13,9.37 17.64,3.89 3.2,3.89 2.06,5.03 PROGRAMMING.2
  Bottom 0.305: v30.18,10.06 31.77,11.66 41.94,11.66 42,11.6 42.37,11.6 IC1.RXD/IO3
TX  (via drill 0.35)
  Top 0.305: v31.77,9.6 30.4,10.97 22.86,10.97 20.16,8.27 2.22,8.27 PROGRAMMING.1
  Bottom 0.305: v31.77,9.6 32.2,9.6 32.4,9.4 42.17,9.4 IC1.TXD/IO1
VCC  (via drill 0.35)
  Top 0.406: 36.47,35.63 41.91,41.07 41.91,42.47 NEOPIXEL15.1 | 12.85,13.5 v12.85,11.18 | 16.3,14.7 16.3,14.68 v20.94,10.04
  Top 0.61: C3.2 6.5,49.2 6.9,49.6 6.9,50.9 5.51,52.29 NEOPIXEL9.1 | C4.2 30.5,49.1 30.9,49.5 30.9,50.9 v29.4,52.4 | C2.2 30.5,25.1 30.9,25.5 30.9,27.1 29.71,28.29 NEOPIXEL5.1 | C1.2 6.5,25.1 7.1,25.7 7.1,26.7 5.51,28.29 NEOPIXEL1.1
  Top 1.27: NEOPIXEL9.1 2.4,52.77 2.4,54 5.8,57.4 8.12,57.4 9.49,56.02 14.38,56.02 NEOPIXEL12.1 16.09,55.12 17.3,56.32 25.91,56.32 28.48,58.9 32.3,58.9 | NEOPIXEL16.1 35.5,58.9 32.3,58.9 | NEOPIXEL13.1 27,52.4 v29.4,52.4 32.3,55.3 32.3,58.9 | NEOPIXEL11.1 19,43.6 20.1,42.5 20.1,41.9 | v26.5,26.3 26.5,27.9 NEOPIXEL5.1 | NEOPIXEL8.1 39.29,32.81 36.47,35.63 v34.8,37.3 32.22,39.88 NEOPIXEL14.1 22.12,39.88 20.1,41.9 | 28.15,14.75 23.79,19.11 21.1,19.11 v21,19.21 20.8,19.01 18.42,19.01 NEOPIXEL3.1 18.12,16.52 16.3,14.7 15.1,13.5 12.85,13.5 8.1,13.5 NEOPIXEL2.1 | 28.15,14.75 v29.6,13.3 40.6,13.3 42.12,14.82 NEOPIXEL7.1 | NEOPIXEL6.1 28.58,14.75 28.15,14.75 | 20.1,41.9 15.5,37.3 | 8.3,37.3 NEOPIXEL10.1 | 15.5,37.3 8.3,37.3 | NEOPIXEL1.1 2.88,31.89 8.3,37.3 | NEOPIXEL4.1 14.29,31.12 13.49,31.92 13.49,35.29 15.5,37.3
  Bottom 0.406: 21.51,8.94 20.68,8.94 RN3.5 20.94,9.06 v20.94,10.04 | RN3.8 22.91,8.94 22.35,8.94 RN3.7 22.07,8.94 21.51,8.94 | 21.51,8.94 RN3.6 | 12.85,8.94 12.29,8.94 RN2.6 | RN2.8 13.69,8.94 13.13,8.94 RN2.7 12.85,8.94 | v12.85,11.18 12.85,8.94 | L1.2 31.85,36.6 31.7,36 | v29.6,13.3 29.03,13.87 IC1.EN
  Bottom 1.016: v29.4,52.4 33.94,47.86 35.2,47.86 36.1,46.96 IC2.4 | v21,19.21 20.89,19.21 17.98,22.13 17.98,25.37 20.63,28.02 25.86,28.02 27.64,29.8
  Bottom 1.27: IC2.4 36.1,40.65 33.77,38.33 | 33.77,38.33 L1.2 | 31.7,36 31.7,34.55 28.35,31.2 C6.1 27.64,30.01 27.64,29.8 27.64,27.44 | 27.64,27.44 IC1.VCC | v34.8,37.3 33.77,38.33 | 27.64,27.44 v26.5,26.3
VDD
  Bottom 0.305: RN1.8 29.95,46.18 29.49,46.18 RN1.7 29.26,46.18 28.57,46.18 RN1.6 28.35,46.18 27.89,46.18 RN1.5 27.66,46.18 27.66,51.89 24.69,54.86 C5.1
  Bottom 0.61: SJ1.2 42.8,59.51 43.11,59.2 | 43.11,59.2 43.6,59.2 43.6,50.52 43.48,50.4 | 43.11,59.2 28.65,59.2 C5.1
  Bottom 1.016: IC2.1 41.2,48.12 43.48,50.4

### Text on the board
bPlace: + - | V0.1.0 | 7-30v input